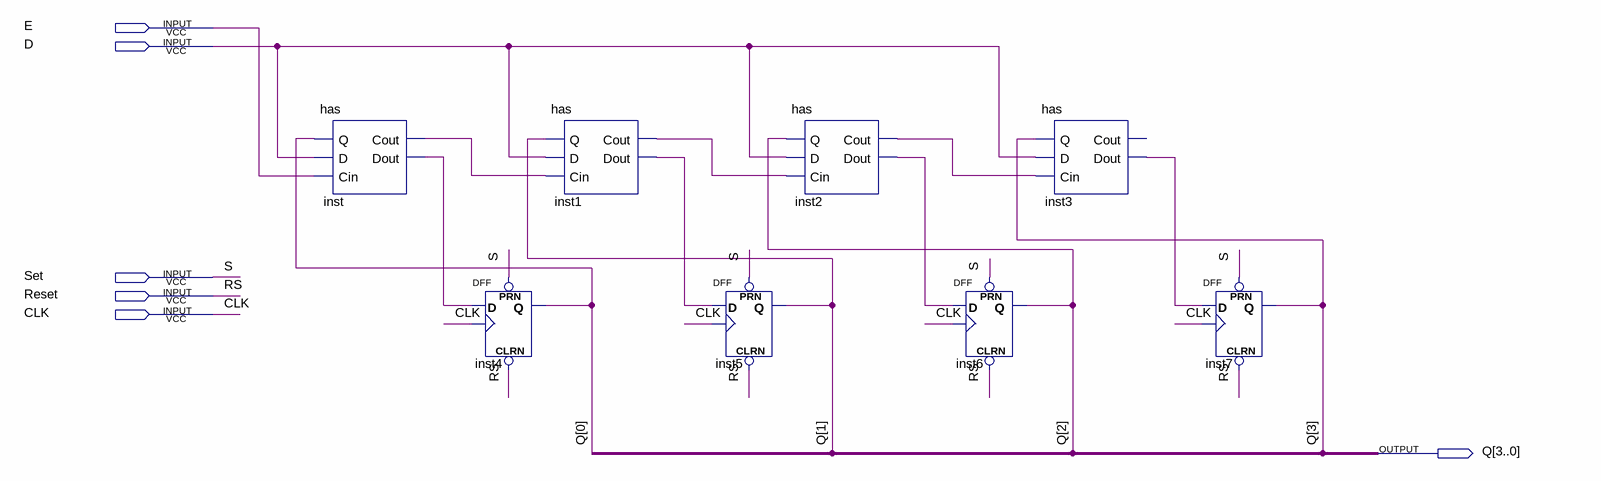
[diagram p0: schematic sheet]
// Quartus schematic top.bdf as structural Verilog: 8 symbols, 6 pins
module top (
  input  E,
  input  D,
  input  Set,
  input  Reset,
  input  CLK,
  output [3:0] Q
);

  wire inst1_cout, inst1_dout, inst2_cout, inst2_dout, inst3_dout, inst_cout, inst_dout;

  has inst (.Q(Q[0]), .D(D), .Cin(E), .Cout(inst_cout), .Dout(inst_dout));
  DFF inst4 (.CLRN(Reset), .CLK(CLK), .D(inst_dout), .PRN(Set), .Q(Q[0]));
  has inst1 (.Q(Q[1]), .D(D), .Cin(inst_cout), .Cout(inst1_cout), .Dout(inst1_dout));
  DFF inst5 (.CLRN(Reset), .CLK(CLK), .D(inst1_dout), .PRN(Set), .Q(Q[1]));
  has inst2 (.Q(Q[2]), .D(D), .Cin(inst1_cout), .Cout(inst2_cout), .Dout(inst2_dout));
  DFF inst6 (.CLRN(Reset), .CLK(CLK), .D(inst2_dout), .PRN(Set), .Q(Q[2]));
  has inst3 (.Q(Q[3]), .D(D), .Cin(inst2_cout), .Dout(inst3_dout));  // open: Cout
  DFF inst7 (.CLRN(Reset), .CLK(CLK), .D(inst3_dout), .PRN(Set), .Q(Q[3]));

  // Other names for the same wires on the sheet: RS = Reset; S = Set
endmodule
